# EAGLE schematic RHA2132_headstage (EAGLE 6.2)
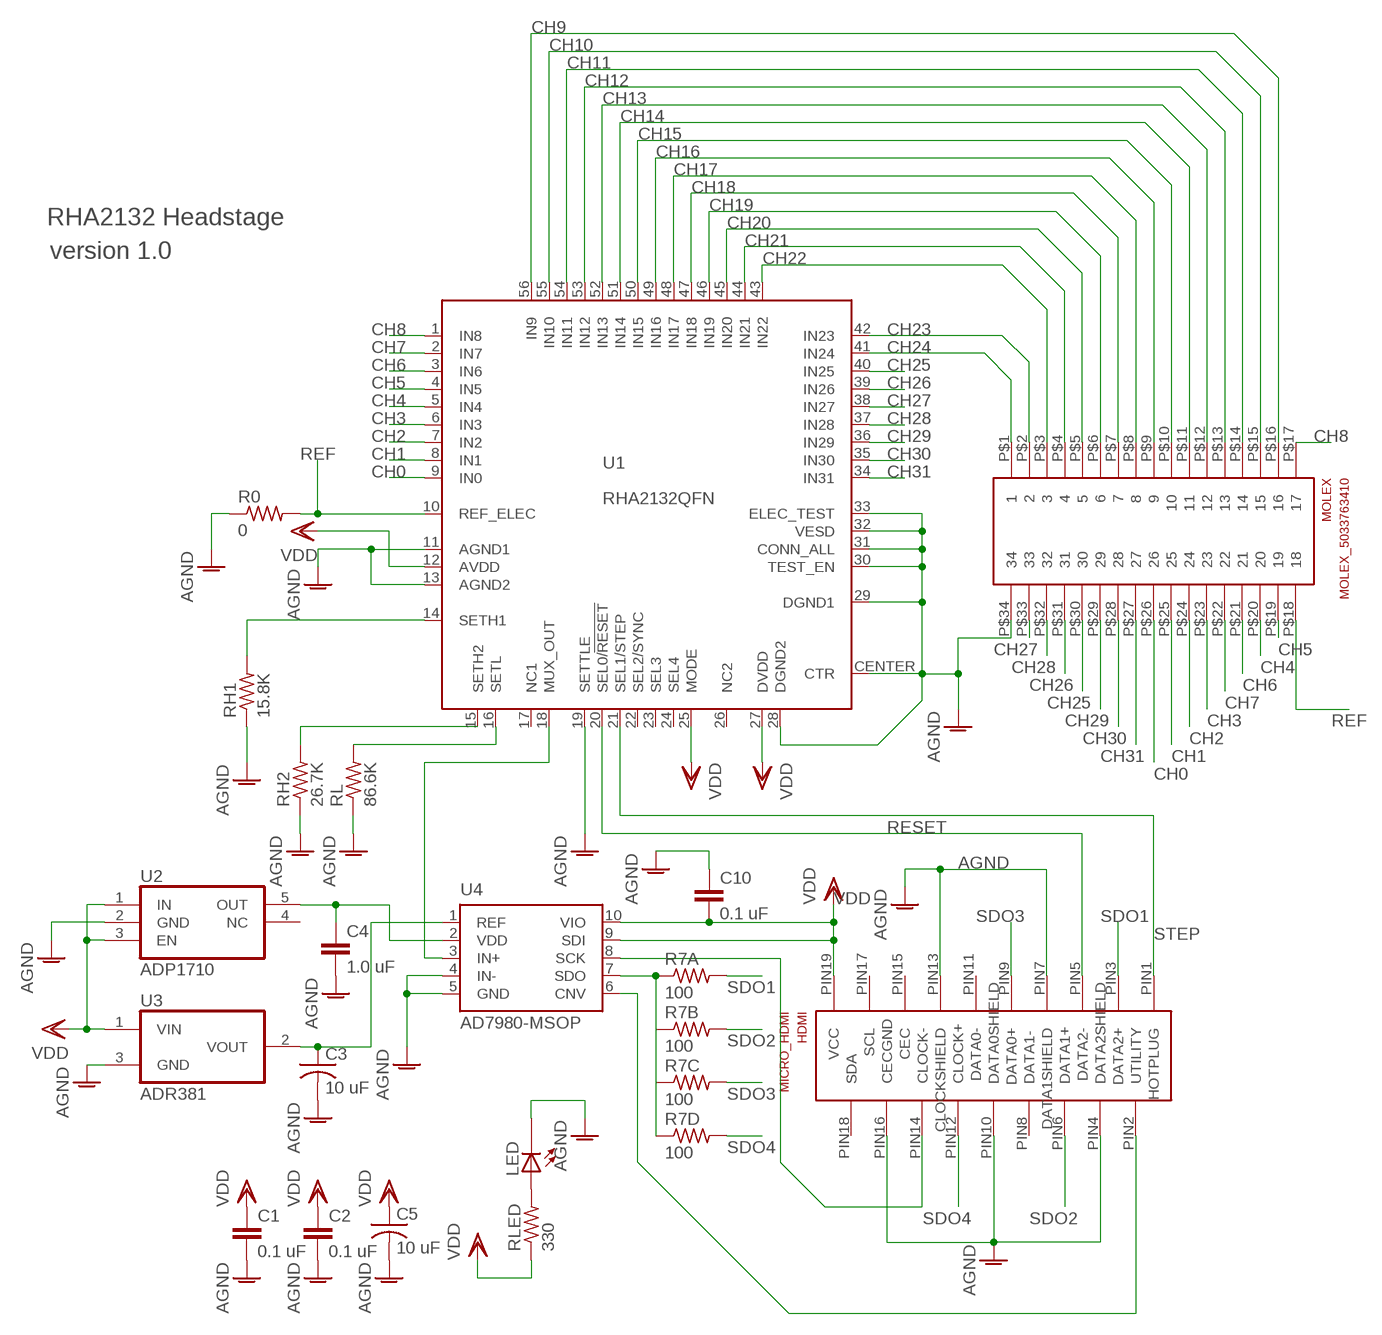
[diagram p0: schematic, sheet 1]

## Parts
C1  0.1 uF  C-EUC0402  [C0402]
C2  0.1 uF  C-EUC0402  [C0402]
C3  10 uF  C-USC0603  [C0603]
C4  1.0 uF  C-EUC0402  [C0402]
C5  10 uF  C-USC0603  [C0603]
C10  0.1 uF  C-EUC0402  [C0402]
HDMI  MICRO_HDMI  [MICRO_HDMI]
LED  LUXEON_REBEL  [LUXEON_REBEL]
MOLEX  MOLEX_5033763410  [MOLEX_5033763410]
R0  0  R-US_R0603  [R0603]
R7A  100  R-US_R0402  [R0402]
R7B  100  R-US_R0402  [R0402]
R7C  100  R-US_R0402  [R0402]
R7D  100  R-US_R0402  [R0402]
RH1  15.8K  R-US_R0402  [R0402]
RH2  26.7K  R-US_R0402  [R0402]
RL  86.6K  R-US_R0402  [R0402]
RLED  330  R-US_R0402  [R0402]
U1  RHA2132QFN  [QFN56_8_X_8]
U2  ADP1710  [TSOT-23-5]
U3  ADR381  [SOT23]
U4  AD7980-MSOP  [MSOP-10]

## Nets
AGND: C1.2 C2.2 C3.2 C4.2 C5.2 C10.1 HDMI.PIN4(DATA2SHIELD) HDMI.PIN7(DATA1SHIELD) HDMI.PIN10(DATA0SHIELD) HDMI.PIN13(CLOCKSHIELD) HDMI.PIN16(CECGND) LED.C MOLEX.P$34 R0.1 RH1.1 RH2.1 RL.1 U1.11(AGND1) U1.13(AGND2) U1.19(SETTLE) U1.28(DGND2) U1.29(DGND1) U1.30(TEST_EN) U1.31(CONN_ALL) U1.32(VESD) U1.33(ELEC_TEST) U1.CENTER(CTR) U2.2(GND) U3.3(GND) U4.4(IN-) U4.5(GND)
CH0: MOLEX.P$26 U1.9(IN0)
CH1: MOLEX.P$25 U1.8(IN1)
CH2: MOLEX.P$24 U1.7(IN2)
CH3: MOLEX.P$23 U1.6(IN3)
CH4: MOLEX.P$20 U1.5(IN4)
CH5: MOLEX.P$19 U1.4(IN5)
CH6: MOLEX.P$21 U1.3(IN6)
CH7: MOLEX.P$22 U1.2(IN7)
CH8: MOLEX.P$17 U1.1(IN8)
CH9: MOLEX.P$16 U1.56(IN9)
CH10: MOLEX.P$15 U1.55(IN10)
CH11: MOLEX.P$14 U1.54(IN11)
CH12: MOLEX.P$13 U1.53(IN12)
CH13: MOLEX.P$12 U1.52(IN13)
CH14: MOLEX.P$11 U1.51(IN14)
CH15: MOLEX.P$10 U1.50(IN15)
CH16: MOLEX.P$9 U1.49(IN16)
CH17: MOLEX.P$8 U1.48(IN17)
CH18: MOLEX.P$7 U1.47(IN18)
CH19: MOLEX.P$6 U1.46(IN19)
CH20: MOLEX.P$5 U1.45(IN20)
CH21: MOLEX.P$4 U1.44(IN21)
CH22: MOLEX.P$3 U1.43(IN22)
CH23: MOLEX.P$2 U1.42(IN23)
CH24: MOLEX.P$1 U1.41(IN24)
CH25: MOLEX.P$30 U1.40(IN25)
CH26: MOLEX.P$31 U1.39(IN26)
CH27: MOLEX.P$33 U1.38(IN27)
CH28: MOLEX.P$32 U1.37(IN28)
CH29: MOLEX.P$29 U1.36(IN29)
CH30: MOLEX.P$28 U1.35(IN30)
CH31: MOLEX.P$27 U1.34(IN31)
N$1: R7A.1 R7D.1 U4.7(SDO)
N$2: HDMI.PIN2(UTILITY) U4.6(CNV)
N$4: HDMI.PIN14(CLOCK-) U4.8(SCK)
N$5: U1.18(MUX_OUT) U4.3(IN+)
N$6: C4.1 U2.5(OUT) U4.2(VDD)
N$7: C3.1 U3.2(VOUT) U4.1(REF)
N$8: RL.2 U1.16(SETL)
N$9: RH2.2 U1.15(SETH2)
N$10: RH1.2 U1.14(SETH1)
N$11: LED.A RLED.2
REF: MOLEX.P$18 R0.2 U1.10(REF_ELEC)
RESET: HDMI.PIN5(DATA2-) U1.20(SEL0/!RESET!)
SDO1: HDMI.PIN3(DATA2+) R7A.2
SDO2: HDMI.PIN6(DATA1+) R7B.2
SDO3: HDMI.PIN9(DATA0+) R7C.2
SDO4: HDMI.PIN12(CLOCK+) R7D.2
STEP: HDMI.PIN1(HOTPLUG) U1.21(SEL1/STEP)
VDD: C1.1 C2.1 C5.1 C10.2 HDMI.PIN19(VCC) RLED.1 U1.12(AVDD) U1.25(MODE) U1.27(DVDD) U2.1(IN) U2.3(EN) U3.1(VIN) U4.9(SDI) U4.10(VIO)
Unconnected: HDMI.PIN8(DATA1-) HDMI.PIN11(DATA0-) HDMI.PIN15(CEC) HDMI.PIN17(SCL) HDMI.PIN18(SDA) LED.A@1(A) LED.C@1(C) R7B.1 R7C.1 U1.17(NC1) U1.22(SEL2/SYNC) U1.23(SEL3) U1.24(SEL4) U1.26(NC2) U2.4(NC)

## Notes on the sheet
- RHA2132 Headstage
- version 1.0

## Power pins joined to a net without a drawn wire
TH: LED.TH LED.TH@1(TH) LED.TH@2(TH) LED.TH@3(TH) LED.TH@4(TH)

## Library data of the parts
C1 C2 C4 C10 = rcl:C-EU: CAPACITOR, European symbol
C3 C5 = rcl:C-US: CAPACITOR, American symbol
HDMI = voigts:MICRO_HDMI
LED = led-lumiled:LUXEON_REBEL: LUXEON Rebel Display layer 93, Pins, and connect all contact points with a net. The thermal pads are defined in a separate gate with addlevel REQUEST. Draw a net named 'TH' and connect all thermal pads with it. Please read the Package's Description about DRC settings. Source: http://www.lumileds.com/pdfs/AB32.pdf
MOLEX = voigts:MOLEX_5033763410
R0 R7A R7B R7C R7D RH1 RH2 RL RLED = rcl:R-US_: RESISTOR, American symbol
U1 = intan:RHA2132
U2 = harrison:ADP1710
U3 = harrison:ADR381
U4 = harrison:AD7980